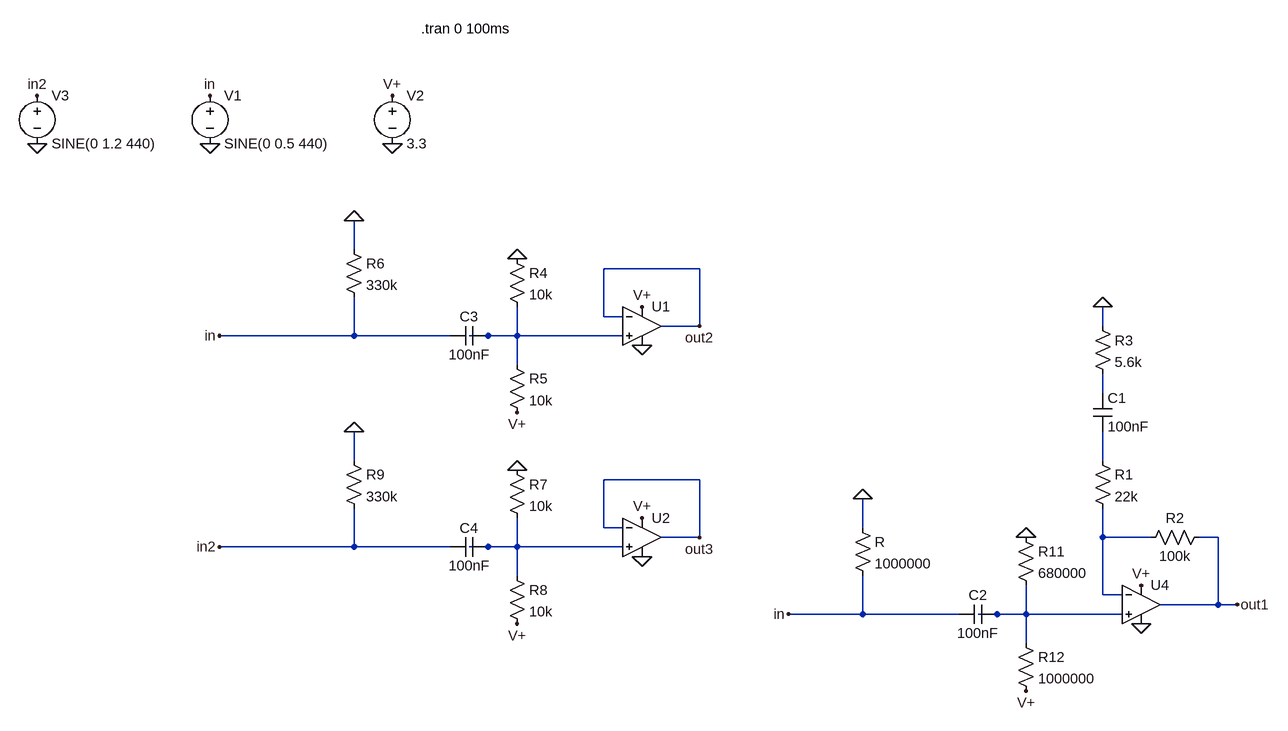
[diagram p0: schematic analog_chord_sense.asc]
analog_chord_sense.asc, the LTspice schematic file:
Version 4.1
SHEET 1 3576 680
WIRE 352 -176 352 -224
WIRE 928 -144 768 -144
WIRE 768 -64 768 -144
WIRE 800 -64 768 -64
WIRE 928 -48 928 -144
WIRE 928 -48 864 -48
WIRE 3280 -48 3280 -80
WIRE 352 -32 352 -96
WIRE 352 -32 128 -32
WIRE 512 -32 352 -32
WIRE 576 -32 544 -32
WIRE 624 -32 624 -80
WIRE 624 -32 576 -32
WIRE 800 -32 624 -32
WIRE 624 16 624 -32
WIRE 3280 64 3280 32
WIRE 352 176 352 128
WIRE 3280 176 3280 128
WIRE 928 208 768 208
WIRE 768 288 768 208
WIRE 800 288 768 288
WIRE 2880 288 2880 240
WIRE 928 304 928 208
WIRE 928 304 864 304
WIRE 3280 304 3280 256
WIRE 3360 304 3280 304
WIRE 3472 304 3440 304
WIRE 352 320 352 256
WIRE 352 320 128 320
WIRE 512 320 352 320
WIRE 576 320 544 320
WIRE 624 320 624 272
WIRE 624 320 576 320
WIRE 800 320 624 320
WIRE 624 368 624 320
WIRE 3280 400 3280 304
WIRE 3312 400 3280 400
WIRE 3472 416 3472 304
WIRE 3472 416 3376 416
WIRE 3504 416 3472 416
WIRE 2880 432 2880 368
WIRE 2880 432 2656 432
WIRE 3040 432 2880 432
WIRE 3104 432 3072 432
WIRE 3152 432 3152 384
WIRE 3152 432 3104 432
WIRE 3312 432 3152 432
WIRE 3152 480 3152 432
FLAG 112 -432 in
FLAG 416 -432 V+
FLAG 3344 384 V+
FLAG 3152 560 V+
FLAG 3504 416 out1
FLAG 3152 304 0
FLAG 3344 448 0
FLAG 416 -352 0
FLAG 112 -352 0
FLAG 2880 240 0
FLAG 2656 432 in
FLAG 3280 -80 0
FLAG 624 96 V+
FLAG 624 -160 0
FLAG 352 -224 0
FLAG 128 -32 in
FLAG 832 -80 V+
FLAG 832 -16 0
FLAG 928 -48 out2
FLAG -176 -432 in2
FLAG -176 -352 0
FLAG 624 448 V+
FLAG 624 192 0
FLAG 352 128 0
FLAG 128 320 in2
FLAG 832 272 V+
FLAG 832 336 0
FLAG 928 304 out3
SYMBOL voltage 112 -448 R0
WINDOW 123 0 0 Left 0
WINDOW 39 0 0 Left 0
SYMATTR InstName V1
SYMATTR Value SINE(0 0.5 440)
SYMBOL voltage 416 -448 R0
WINDOW 123 0 0 Left 0
WINDOW 39 0 0 Left 0
SYMATTR InstName V2
SYMATTR Value 3.3
SYMBOL OpAmps\\UniversalOpAmp2 3344 416 R0
SYMATTR InstName U4
SYMBOL res 3136 288 R0
SYMATTR InstName R11
SYMATTR Value 680000
SYMBOL res 3136 464 R0
SYMATTR InstName R12
SYMATTR Value 1000000
SYMBOL cap 3104 416 R90
WINDOW 0 0 32 VBottom 2
WINDOW 3 32 32 VTop 2
SYMATTR InstName C2
SYMATTR Value 100nF
SYMBOL res 3456 288 R90
WINDOW 0 0 56 VBottom 2
WINDOW 3 32 56 VTop 2
SYMATTR InstName R2
SYMATTR Value 100k
SYMBOL res 2864 272 R0
SYMATTR InstName R
SYMATTR Value 1000000
SYMBOL res 3264 160 R0
SYMATTR InstName R1
SYMATTR Value 22k
SYMBOL res 3264 -64 R0
SYMATTR InstName R3
SYMATTR Value 5.6k
SYMBOL cap 3264 64 R0
SYMATTR InstName C1
SYMATTR Value 100nF
SYMBOL res 608 -176 R0
SYMATTR InstName R4
SYMATTR Value 10k
SYMBOL res 608 0 R0
SYMATTR InstName R5
SYMATTR Value 10k
SYMBOL cap 576 -48 R90
WINDOW 0 0 32 VBottom 2
WINDOW 3 32 32 VTop 2
SYMATTR InstName C3
SYMATTR Value 100nF
SYMBOL res 336 -192 R0
SYMATTR InstName R6
SYMATTR Value 330k
SYMBOL OpAmps\\UniversalOpAmp2 832 -48 R0
SYMATTR InstName U1
SYMBOL voltage -176 -448 R0
WINDOW 123 0 0 Left 0
WINDOW 39 0 0 Left 0
SYMATTR InstName V3
SYMATTR Value SINE(0 1.2 440)
SYMBOL res 608 176 R0
SYMATTR InstName R7
SYMATTR Value 10k
SYMBOL res 608 352 R0
SYMATTR InstName R8
SYMATTR Value 10k
SYMBOL cap 576 304 R90
WINDOW 0 0 32 VBottom 2
WINDOW 3 32 32 VTop 2
SYMATTR InstName C4
SYMATTR Value 100nF
SYMBOL res 336 160 R0
SYMATTR InstName R9
SYMATTR Value 330k
SYMBOL OpAmps\\UniversalOpAmp2 832 304 R0
SYMATTR InstName U2
TEXT 464 -544 Left 2 !.tran 0 100ms

The netlist it stands for:
* analog_chord_sense.asc
V1 in 0 SINE(0 0.5 440)
V2 V+ 0 3.3
X§U4 N006 N004 V+ 0 out1 level2 Avol=1Meg GBW=10Meg Slew=10Meg Ilimit=25m Rail=0 Vos=0 En=0 Enk=0 In=0 Ink=0 Rin=500Meg  ; pins In+ In- V+ V- OUT
R11 0 N006 680000
R12 N006 V+ 1000000
C2 N006 in 100nF
R2 out1 N004 100k
R 0 in 1000000
R1 N003 N004 22k
R3 0 N002 5.6k
C1 N002 N003 100nF
R4 0 N001 10k
R5 N001 V+ 10k
C3 N001 in 100nF
R6 0 in 330k
X§U1 N001 out2 V+ 0 out2 level2 Avol=1Meg GBW=10Meg Slew=10Meg Ilimit=25m Rail=0 Vos=0 En=0 Enk=0 In=0 Ink=0 Rin=500Meg  ; pins In+ In- V+ V- OUT
V3 in2 0 SINE(0 1.2 440)
R7 0 N005 10k
R8 N005 V+ 10k
C4 N005 in2 100nF
R9 0 in2 330k
X§U2 N005 out3 V+ 0 out3 level2 Avol=1Meg GBW=10Meg Slew=10Meg Ilimit=25m Rail=0 Vos=0 En=0 Enk=0 In=0 Ink=0 Rin=500Meg  ; pins In+ In- V+ V- OUT
.tran 0 100ms
.lib UniversalOpAmp2.lib
.backanno
.end